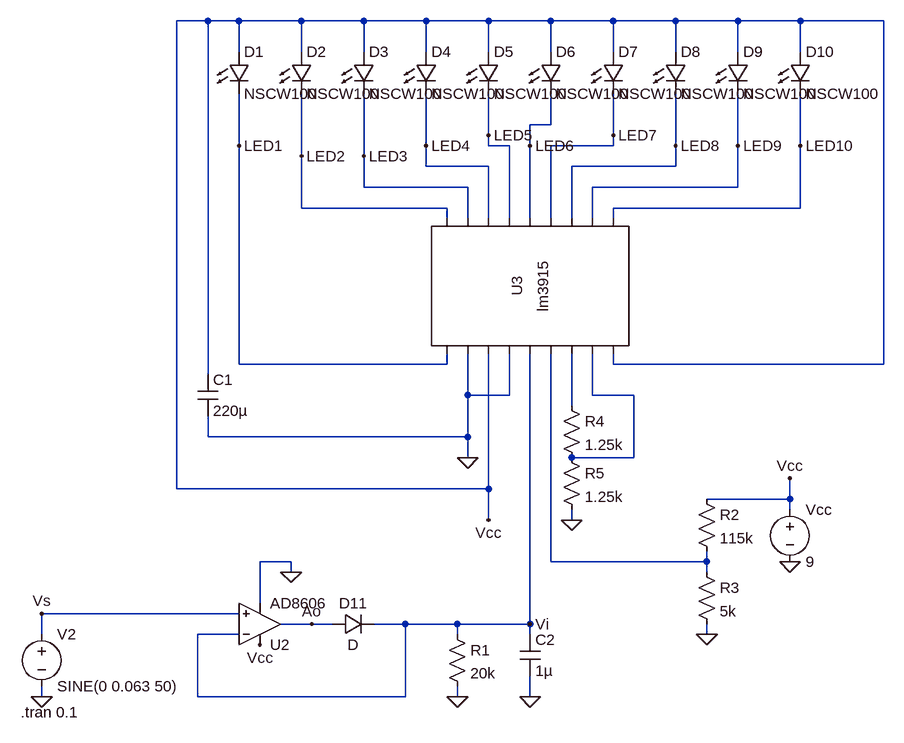
[diagram p0: schematic LM3915_Base_Circuit.asc]
LM3915_Base_Circuit.asc, the LTspice schematic file:
Version 4
SHEET 1 1420 680
WIRE -192 -832 -240 -832
WIRE -144 -832 -192 -832
WIRE -48 -832 -144 -832
WIRE 48 -832 -48 -832
WIRE 144 -832 48 -832
WIRE 240 -832 144 -832
WIRE 336 -832 240 -832
WIRE 432 -832 336 -832
WIRE 528 -832 432 -832
WIRE 624 -832 528 -832
WIRE 720 -832 624 -832
WIRE 848 -832 720 -832
WIRE -144 -784 -144 -832
WIRE -48 -784 -48 -832
WIRE 48 -784 48 -832
WIRE 144 -784 144 -832
WIRE 240 -784 240 -832
WIRE 336 -784 336 -832
WIRE 432 -784 432 -832
WIRE 528 -784 528 -832
WIRE 624 -784 624 -832
WIRE 720 -784 720 -832
WIRE 336 -672 336 -720
WIRE 336 -672 304 -672
WIRE 240 -656 240 -720
WIRE 432 -656 432 -720
WIRE -144 -640 -144 -720
WIRE 144 -640 144 -720
WIRE 240 -640 240 -656
WIRE 272 -640 240 -640
WIRE 304 -640 304 -672
WIRE 432 -640 432 -656
WIRE 432 -640 336 -640
WIRE 528 -640 528 -720
WIRE 624 -640 624 -720
WIRE 720 -640 720 -720
WIRE -48 -624 -48 -720
WIRE 48 -624 48 -720
WIRE 144 -608 144 -640
WIRE 240 -608 144 -608
WIRE 528 -608 528 -640
WIRE 528 -608 368 -608
WIRE 48 -576 48 -624
WIRE 208 -576 48 -576
WIRE 624 -576 624 -640
WIRE 624 -576 400 -576
WIRE -48 -544 -48 -624
WIRE 176 -544 -48 -544
WIRE 720 -544 720 -640
WIRE 720 -544 432 -544
WIRE 176 -528 176 -544
WIRE 208 -528 208 -576
WIRE 240 -528 240 -608
WIRE 272 -528 272 -640
WIRE 304 -528 304 -640
WIRE 336 -528 336 -640
WIRE 368 -528 368 -608
WIRE 400 -528 400 -576
WIRE 432 -528 432 -544
WIRE -144 -304 -144 -640
WIRE 176 -304 176 -320
WIRE 176 -304 -144 -304
WIRE 432 -304 432 -320
WIRE 848 -304 848 -832
WIRE 848 -304 432 -304
WIRE -192 -288 -192 -832
WIRE 208 -256 208 -320
WIRE 272 -256 272 -320
WIRE 272 -256 208 -256
WIRE 400 -256 400 -320
WIRE 464 -256 400 -256
WIRE 368 -240 368 -320
WIRE -192 -192 -192 -224
WIRE 208 -192 208 -256
WIRE 208 -192 -192 -192
WIRE 208 -160 208 -192
WIRE 464 -160 464 -256
WIRE 464 -160 368 -160
WIRE -240 -112 -240 -832
WIRE 240 -112 240 -320
WIRE 240 -112 -240 -112
WIRE 704 -96 704 -128
WIRE 704 -96 576 -96
WIRE 704 -80 704 -96
WIRE 240 -64 240 -112
WIRE 368 -64 368 -80
WIRE -64 0 -112 0
WIRE 336 0 336 -320
WIRE 576 0 576 -16
WIRE 576 0 336 0
WIRE -64 16 -64 0
WIRE 576 16 576 0
WIRE -112 64 -112 0
WIRE -144 80 -448 80
WIRE -32 96 -80 96
WIRE 0 96 -32 96
WIRE 112 96 64 96
WIRE 192 96 112 96
WIRE 304 96 304 -320
WIRE 304 96 192 96
WIRE -448 112 -448 80
WIRE -144 112 -208 112
WIRE 192 112 192 96
WIRE 304 112 304 96
WIRE 576 112 576 96
WIRE -448 208 -448 192
WIRE -208 208 -208 112
WIRE 112 208 112 96
WIRE 112 208 -208 208
WIRE 192 208 192 192
WIRE 304 208 304 176
FLAG 208 -160 0
FLAG 704 0 0
FLAG -112 128 Vcc
FLAG -448 208 0
FLAG 192 208 0
FLAG -448 80 Vs
FLAG 704 -128 Vcc
FLAG -32 96 Ao
FLAG -64 16 0
FLAG 304 208 0
FLAG 304 96 Vi
FLAG 576 112 0
FLAG 368 -64 0
FLAG 240 -64 Vcc
FLAG -144 -640 LED1
FLAG -48 -624 LED2
FLAG 48 -624 LED3
FLAG 144 -640 LED4
FLAG 240 -656 LED5
FLAG 304 -640 LED6
FLAG 432 -656 LED7
FLAG 528 -640 LED8
FLAG 624 -640 LED9
FLAG 720 -640 LED10
SYMBOL LED -160 -784 R0
SYMATTR InstName D1
SYMATTR Value NSCW100
SYMBOL LED -64 -784 R0
SYMATTR InstName D2
SYMATTR Value NSCW100
SYMBOL LED 32 -784 R0
SYMATTR InstName D3
SYMATTR Value NSCW100
SYMBOL LED 128 -784 R0
SYMATTR InstName D4
SYMATTR Value NSCW100
SYMBOL LED 224 -784 R0
SYMATTR InstName D5
SYMATTR Value NSCW100
SYMBOL LED 320 -784 R0
SYMATTR InstName D6
SYMATTR Value NSCW100
SYMBOL LED 416 -784 R0
SYMATTR InstName D7
SYMATTR Value NSCW100
SYMBOL LED 512 -784 R0
SYMATTR InstName D8
SYMATTR Value NSCW100
SYMBOL LED 608 -784 R0
SYMATTR InstName D9
SYMATTR Value NSCW100
SYMBOL LED 704 -784 R0
SYMATTR InstName D10
SYMATTR Value NSCW100
SYMBOL cap -208 -288 R0
SYMATTR InstName C1
SYMATTR Value 220µ
SYMBOL voltage 704 -96 R0
WINDOW 123 0 0 Left 0
WINDOW 39 0 0 Left 0
SYMATTR InstName Vcc
SYMATTR Value 9
SYMBOL voltage -448 96 R0
WINDOW 123 0 0 Left 0
WINDOW 39 0 0 Left 0
SYMATTR InstName V2
SYMATTR Value SINE(0 0.063 50)
SYMBOL res 176 96 R0
SYMATTR InstName R1
SYMATTR Value 20k
SYMBOL diode 0 112 R270
WINDOW 0 32 32 VTop 2
WINDOW 3 0 32 VBottom 2
SYMATTR InstName D11
SYMBOL OpAmps\\AD8606 -112 160 M180
SYMATTR InstName U2
SYMBOL cap 288 112 R0
SYMATTR InstName C2
SYMATTR Value 1µ
SYMBOL AutoGenerated\\lm3915 304 -416 R270
SYMATTR InstName U3
SYMBOL res 560 -112 R0
SYMATTR InstName R2
SYMATTR Value 115k
SYMBOL res 560 0 R0
SYMATTR InstName R3
SYMATTR Value 5k
SYMBOL res 352 -256 R0
SYMATTR InstName R4
SYMATTR Value 1.25k
SYMBOL res 352 -176 R0
SYMATTR InstName R5
SYMATTR Value 1.25k
TEXT -480 232 Left 2 !.tran 0.1

The netlist it stands for:
* LM3915_Base_Circuit.asc
D1 Vcc LED1 NSCW100
D2 Vcc LED2 NSCW100
D3 Vcc LED3 NSCW100
D4 Vcc LED4 NSCW100
D5 Vcc LED5 NSCW100
D6 Vcc LED6 NSCW100
D7 Vcc LED7 NSCW100
D8 Vcc LED8 NSCW100
D9 Vcc LED9 NSCW100
D10 Vcc LED10 NSCW100
C1 Vcc 0 220µ
Vcc Vcc 0 9
V2 Vs 0 SINE(0 0.063 50)
R1 Vi 0 20k
D11 Ao Vi D
XU2 Vs Vi Vcc 0 Ao AD8606  ; pins In+ In- V+ V- OUT
C2 Vi 0 1µ
* U3: lm3915 (symbol AutoGenerated\lm3915 not available, pins judged from their places): pin1=LED1 pin2=0 pin3=Vcc pin4=0 pin5=Vi pin6=N003 pin7=N002 pin8=N001 pin9=Vcc pin10=LED2 pin11=LED3 pin12=LED4 pin13=LED5 pin14=LED6 pin15=LED7 pin16=LED8 pin17=LED9 pin18=LED10
R2 Vcc N003 115k
R3 N003 0 5k
R4 N002 N001 1.25k
R5 N001 0 1.25k
.model D D
.lib standard.dio
.tran 0.1
.lib ADI.lib
.backanno
.end